# Altium schematic sheet Power.SchDoc
size A4; SheetNumber: 3; SheetTotal: 3
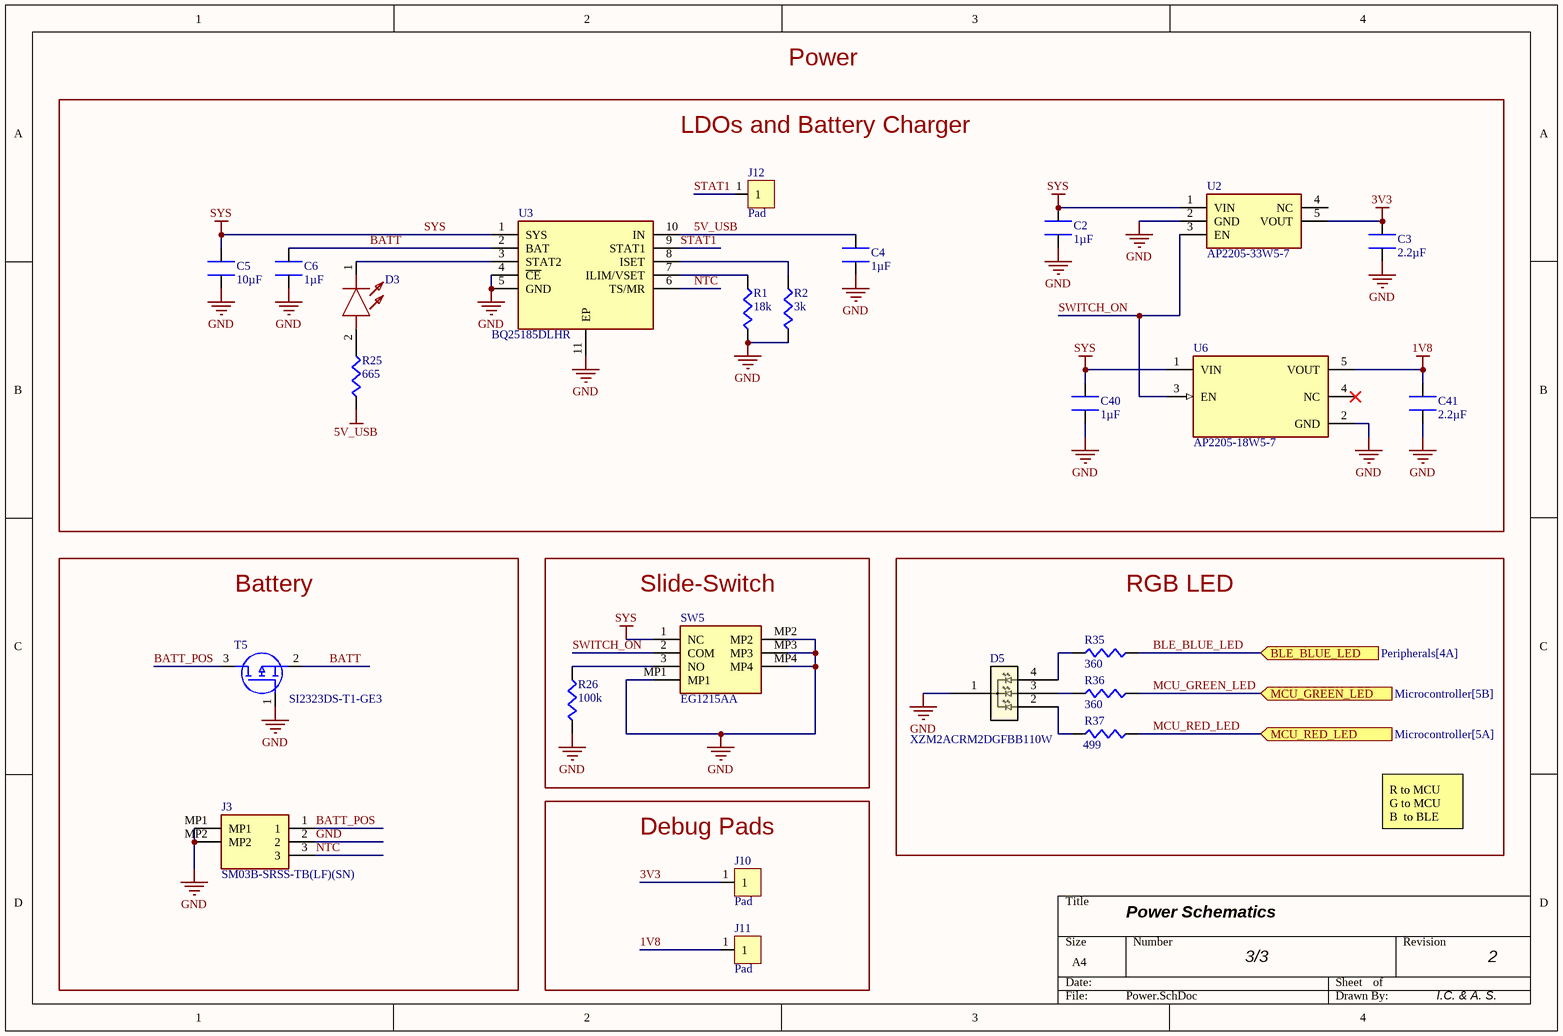
[diagram p0: Power.SchDoc]

## Parts
C2  value 1µF  [Chip2PinSM127P600-8N]  (hidden comment: 0402YD105KAT4A)
C3  value 2.2µF  [Chip2PinSM127P600-8N]  (hidden comment: LMK105BJ225MV-F)
C4  value 1µF  [Chip2PinSM127P600-8N]  (hidden comment: CL03A105KP3NSNC)
C5  value 10µF  [Chip2PinSM127P600-8N]  (hidden comment: 0402ZD106MAT2A)
C6  value 1µF  [Chip2PinSM127P600-8N]  (hidden comment: CL03A105KP3NSNC)
C40  value 1µF  [Chip2PinSM127P600-8N]  (hidden comment: 0402YD105KAT4A)
C41  value 2.2µF  [Chip2PinSM127P600-8N]  (hidden comment: LMK105BJ225MV-F)
D3  KS EELP41.22-P1R2-58-A8J8-020-R18  [KS EELP41.22-P1R2-58-A8J8-020-R18-Footprint-1]  (value not drawn)
D5  XZM2ACRM2DGFBB110W  [XZM2ACRM2DGFBB110W-Footprint-1]
J3  SM03B-SRSS-TB(LF)(SN)  [SM03B-SRSS-TB(LF)(SN)-Footprint-1]
J10  Pad  [Pad-Footprint-1]  (no BOM)
J11  Pad  [Pad-Footprint-1]  (no BOM)
J12  Pad  [Pad-Footprint-1]  (no BOM)
R1  value 18k  [Chip2PinSM127P600-8N]  (hidden comment: TNPW020118K0BEED)
R2  value 3k  [Chip2PinSM127P600-8N]  (hidden comment: TNPW02013K00BEED)
R25  value 665  [Chip2PinSM127P600-8N]  (hidden comment: CRCW0201665RFKED)
R26  value 100k  [Chip2PinSM127P600-8N]  (hidden comment: ERJ-1GNJ104C)
R35  value 360  [Chip2PinSM127P600-8N]  (hidden comment: CRCW0201360RFKED)
R36  value 360  [Chip2PinSM127P600-8N]  (hidden comment: CRCW0201360RFKED)
R37  value 499  [Chip2PinSM127P600-8N]  (hidden comment: ERA-1AEB4990C)
SW5  EG1215AA  [EG1215AA-Footprint-1]
T5  SI2323DS-T1-GE3  [SI2323DS-T1-GE3-Footprint-1]
U2  AP2205-33W5-7  [AP2205-33W5-7-Footprint-1]
U3  BQ25185DLHR  [BQ25185DLHR-Footprint-1]
U6  AP2205-18W5-7  [AP2205-18W5-7-Footprint-1]

## Blocks framed on the sheet
LDOs and Battery Charger: C2-C6 C40 C41 D3 J12 R1 R2 R25 U2 U3 U6
Battery: J3 T5
Slide-Switch: R26 SW5
RGB LED: D5 R35-R37
Debug Pads: J10 J11

## Ports
BLE_BLUE_LED (in, see Peripherals[4A]), MCU_GREEN_LED (in, see Microcontroller[5B]), MCU_RED_LED (in, see Microcontroller[5A])

## Nets
1V8: C41.2 J11.1 U6.5(VOUT)
3V3: C3.2 J10.1 U2.5(VOUT)
5V_USB: C4.2 R25.1 U3.10(IN)
GND: C2.1 C3.1 C4.1 C5.2 C6.1 C40.1 C41.1 D5.1 J3.2 J3.MP1 J3.MP2 R1.1 R2.1 R26.1 SW5.MP1 SW5.MP2 SW5.MP3 SW5.MP4 T5.1(G) U2.2(GND) U3.4(~{CE}) U3.5(GND) U3.11(EP) U6.2(GND)
SYS: C2.2 C5.1 C40.2 SW5.1(NC) U2.1(VIN) U3.1(SYS) U6.1(VIN)
BATT: C6.2 T5.2(S) U3.2(BAT)
BATT_POS: J3.1 T5.3(D)
BLE_BLUE_LED: R35.2 ; port BLE_BLUE_LED
MCU_GREEN_LED: R36.2 ; port MCU_GREEN_LED
MCU_RED_LED: R37.2 ; port MCU_RED_LED
NTC: J3.3 U3.6(TS/MR)
STAT1: J12.1 U3.9(STAT1)
SWITCH_ON: SW5.2(COM) U2.3(EN) U6.3(EN)
NetD3_1: D3.1(K) U3.3(STAT2)
NetD3_2: D3.2(A) R25.2
NetD5_2: D5.2 R37.1
NetD5_3: D5.3 R36.1
NetD5_4: D5.4 R35.1
NetR1_2: R1.2 U3.7(ILIM/VSET)
NetR2_2: R2.2 U3.8(ISET)
NetR26_2: R26.2 SW5.3(NO)

Not connected (* = marked no-connect by the designer): U2 4(NC); U6 4(NC)*

## Notes on the sheet
- Power
- R to MCU
  G to MCU
  B  to BLE
- Power Schematics
- 3/3
- 2
- I.C. & A. S.

## Library data of the parts
C2 C40 = CMP-001-00107-6: Ceramic Capacitor, Multilayer, Ceramic, 16V, 10% +Tol, 10% -Tol, X5R, 15% TC, 1uF, Surface Mount, 0402; Min Operating Temperature: -55°C; RoHS Compliant: Yes; Case/Package: 0402; Pins: 2; Mounting Technology: Surface Mount; Max Operating Temperature: 85°C; Capacitor Type: Ceramic
C3 C41 = CMP-001-00130-1: Ceramic Capacitor, Multilayer, Ceramic, 10V, 20% +Tol, 20% -Tol, X5R, 15% TC, 2.2uF, Surface Mount, 0402; Capacitor Type: Ceramic; Mounting Technology: Surface Mount; Case/Package: 0402; Min Operating Temperature: -55°C; Max Operating Temperature: 85°C; RoHS Compliant: Yes; Pins: 2
C4 C6 = CMP-001-00095-4: Ceramic Capacitor, Multilayer, Ceramic, 10V, 10% +Tol, 10% -Tol, X5R, 15% TC, 1uF, Surface Mount, 0201; Min Operating Temperature: -55°C; Capacitor Type: Ceramic; Pins: 2; Max Operating Temperature: 85°C; Mounting Technology: Surface Mount; Case/Package: 0201; RoHS Compliant: Yes
C5 = CMP-00044-1: Ceramic Capacitor, Multilayer, Ceramic, 10V, 20% +Tol, 20% -Tol, X5R, 15% TC, 10uF, Surface Mount, 0402; Multilayer: Yes; Rated DC Voltage (URdc): 10V; Packaging: Tape and Reel; Dielectric Material: Ceramic; Mounting Technology: Surface Mount; Tolerance (fill in as +-): 20%; Terminal Finish: Nickel; Termination: Wraparound; JESD-609 Code: e3; Pins: 2; Max Operating Temperature: 85°C; Temperature Characteristics Code: X5R; RoHS Compliant: Yes; Tolerance  (fill in as +-): 20%; Min Operating Temperature: -55°C; Reach SVHC Compliant: Yes; Capacitor Type: Ceramic; Package Shape: Rectangular; Case/Package: 0402
D3 = CMP-007-00048-1: Single Colour LEDs
D5 = CMP-00156-4: 1.6X1.6MM Rgb Full Color SMD Led
J3 = CMP-002-00112-1: Connector Header, Side Entry, SR Series, 3 Position, 1.00mm, 50V, Surface Mount, Tin, Natural; Gender: Male; Connector Type: Male Pin; Max Current Rating: 1A; Min Operating Temperature: -25°C; Mounting Technology: Surface Mount, Termination; Max Operating Temperature: 85°C; Pins: 3; Voltage Rating: 50V
J10-J12 = CMP-002-00075-4: Pad to connect external electrodes or sensors. Choose the right footprint.
R1 = CMP-009-00240-1: Fixed Resistor, Thin Film, 0.05W, 18000ohm, 25V, 0.1% +/-Tol, 25ppm/Cel, Surface Mount, 0201; Min Operating Temperature: -55°C; Max Operating Temperature: 125°C; Mounting Technology: Surface Mount; Tolerance: 0.1%
R2 = CMP-009-00239-1: Fixed Resistor, Thin Film, 0.05W, 3000ohm, 25V, 0.1% +/-Tol, 25ppm/Cel, Surface Mount, 0201; Tolerance: 0.1%; Min Operating Temperature: -55°C; Max Operating Temperature: 125°C; Case/Package: 0201; Mounting Technology: Surface Mount; Voltage Rating: 25V
R25 = CMP-009-00207-1: Fixed Resistor, Metal Glaze/thick Film, 0.05W, 665ohm, 30V, 1% +/-Tol, 100ppm/Cel, Surface Mount, 0201; Power: 50mW; Tolerance: 1%; RoHS Compliant: Yes; Max Operating Temperature: 155°C; Mounting Technology: Surface Mount; Pins: 2; Case/Package: 0201; Min Operating Temperature: -55°C
R26 = CMP-009-00199-1: Fixed Resistor, Metal Glaze/thick Film, 0.05W, 100000ohm, 25V, 5% +/-Tol, 200ppm/Cel, Surface Mount, 0201; Power: 50mW; Min Operating Temperature: -55°C; Max Operating Temperature: 125°C; RoHS Compliant: Yes; Pins: 2; Case/Package: 0201; Mounting Technology: Surface Mount; Tolerance: 5%
R35 R36 = CMP-009-00209-1: Fixed Resistor, Metal Glaze/thick Film, 0.05W, 360ohm, 30V, 1% +/-Tol, 100ppm/Cel, Surface Mount, 0201; Power: 50mW; Min Operating Temperature: -55°C; Max Operating Temperature: 155°C; Mounting Technology: Surface Mount; Case/Package: 0201; Tolerance: 1%; Pins: 2; RoHS Compliant: Yes
R37 = CMP-009-00210-1: 0201 Thin film chip resistor 0201 SMD Resistor 0.1% 25ppm 499ohm
SW5 = CMP-011-00016-4: Slide Switch
T5 = CMP-013-00036-3: Small Signal Field-Effect Transistor, 3.7A I(D), 20V, 1-Element, P-Channel, Silicon, Metal-oxide Semiconductor FET, TO-236AB; Max Operating Temperature: 150°C; Pins: 3; RoHS Compliant: Yes
U2 = CMP-019-00075-1: Fixed LDO Voltage Regulator, 2.3V to 24V in, 360mV Drop, 3.3V out, 200mA out, SOT-25-5; Output Voltage: 3.3V; Max Supply Voltage: 24V
U3 = CMP-019-00076-1: 1-cell, 1-A stand-alone linear battery charger with power path and solar input support 10-WSON -40 to 125; Pins: 10
U6 = CMP-019-00067-1: LDO Voltage Regulators LDO CMOS LowCurr. 1.8V fixed